# EAGLE design 608_donkey (EAGLE 9.6.2)
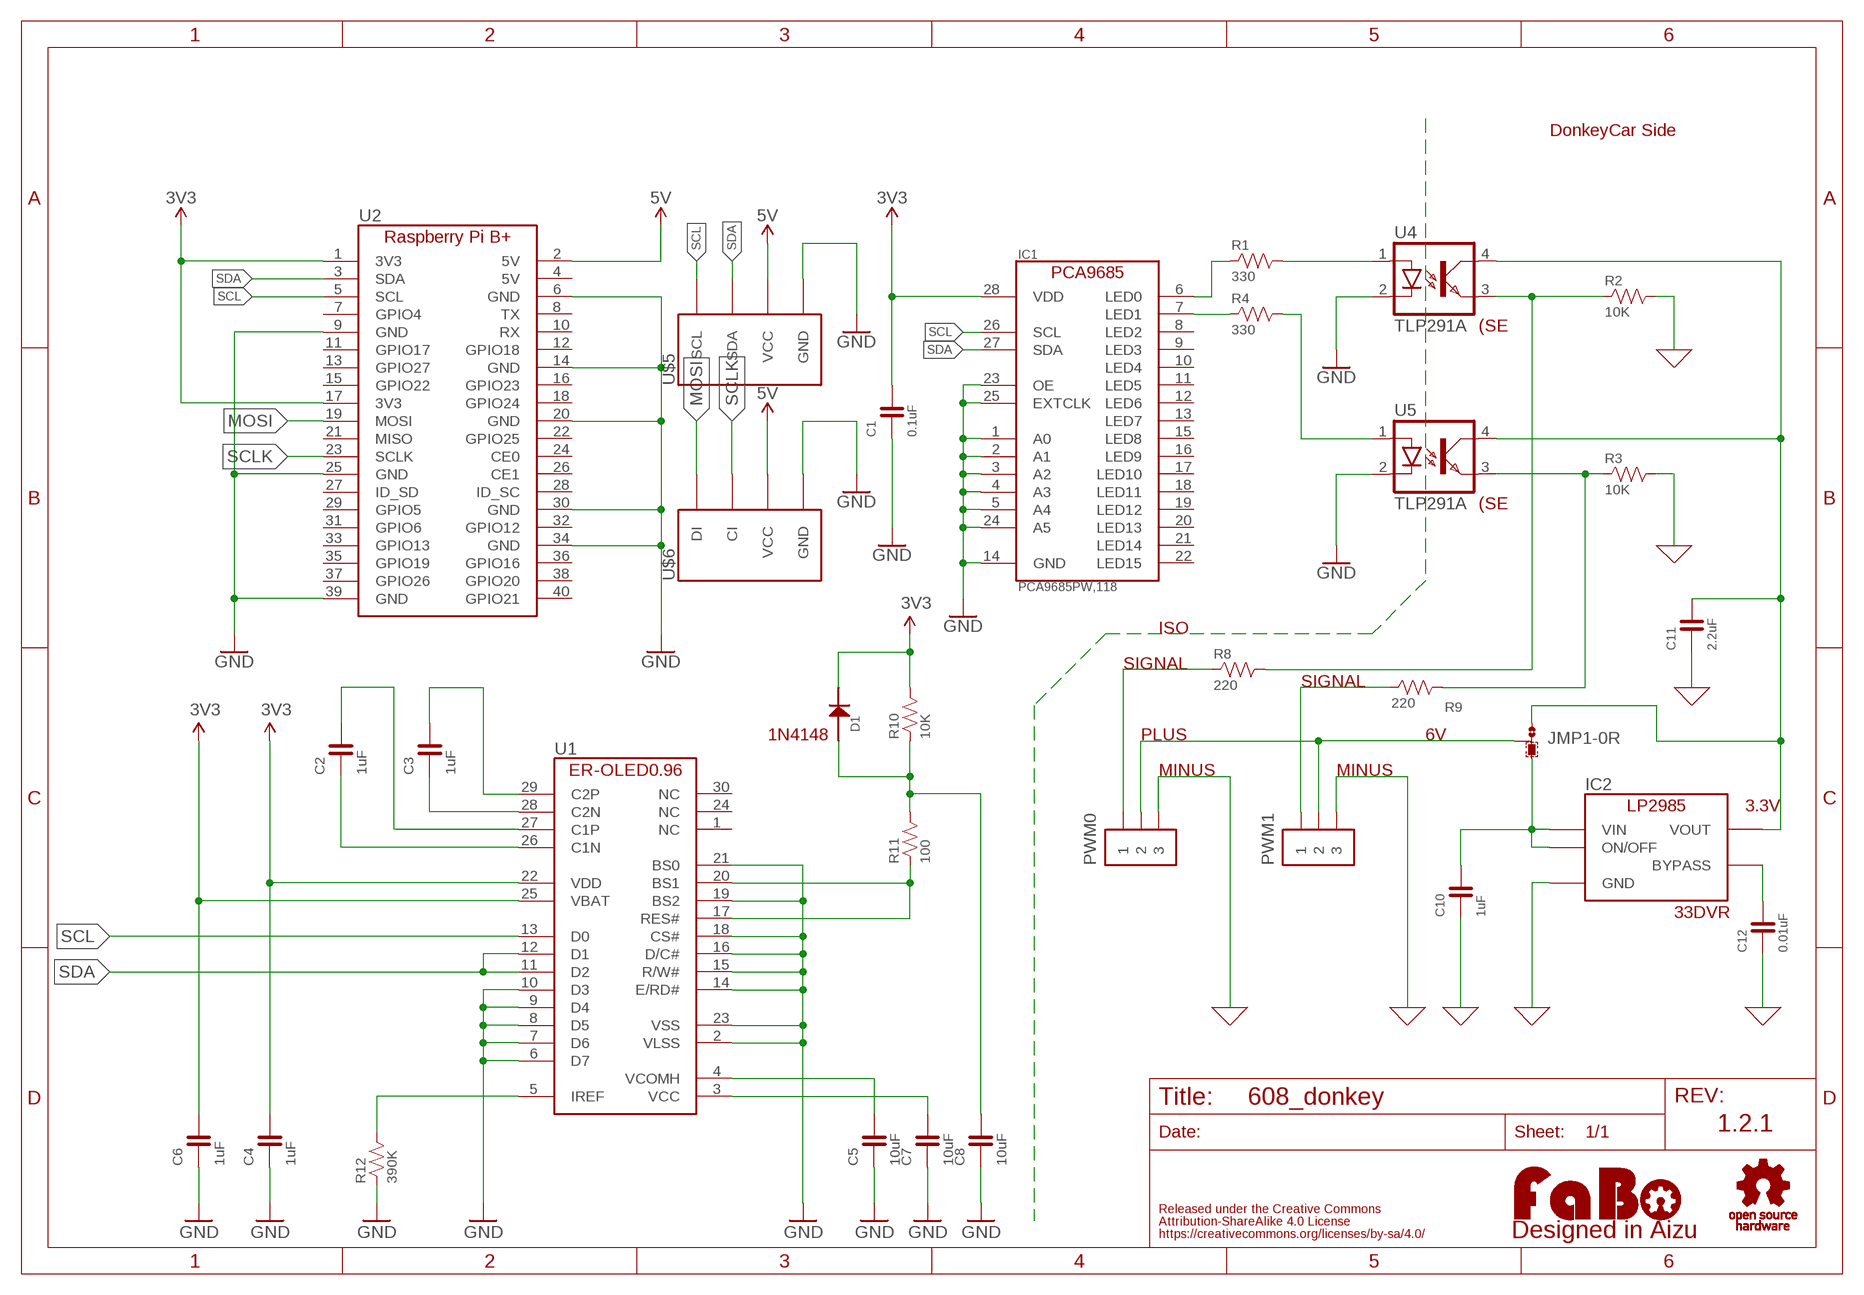
[diagram p0: schematic, sheet 1]

## Parts
C1  0.1uF  CAPACITOR-0603  [EIA0603]
C2  1uF  CAPACITOR-0603-BOTTOM  [0603-BOTTOM]
C3  1uF  CAPACITOR-0603-BOTTOM  [0603-BOTTOM]
C4  1uF  CAPACITOR-0603-BOTTOM  [0603-BOTTOM]
C5  10uF  CAPACITOR-0603-BOTTOM  [0603-BOTTOM]
C6  1uF  CAPACITOR-0603-BOTTOM  [0603-BOTTOM]
C7  10uF  CAPACITOR-0603-BOTTOM  [0603-BOTTOM]
C8  10uF  CAPACITOR-0603-BOTTOM  [0603-BOTTOM]
C10  1uF  CAPACITOR-0603  [EIA0603]
C11  2.2uF  CAPACITOR-0603  [EIA0603]
C12  0.01uF  CAPACITOR-0603  [EIA0603]
D1  1N4148  [1N4148W]
IC1  PCA9685PW,118  PCA9685PW  [TSSOP-28]
IC2  LP2985-33DBV  [SOT-23-5]
JMP1  0R-JUMPB  [B0R-JMP]
LOGO1  LOGO_FABO-M  [LOGO_FABO_M]
PWM0  PIN_HEADER_1X3  [PIN_1X3]
PWM1  PIN_HEADER_1X3  [PIN_1X3]
R1  330  RESISTOR-0603-NARROW  [0603-NARROW]
R2  10K  RESISTOR-0603-NARROW  [0603-NARROW]
R3  10K  RESISTOR-0603-NARROW  [0603-NARROW]
R4  330  RESISTOR-0603-NARROW  [0603-NARROW]
R8  220  RESISTOR-0603-NARROW  [0603-NARROW]
R9  220  RESISTOR-0603-NARROW  [0603-NARROW]
R10  10K  RESISTOR-0603-BOTTOM  [0603-BOTTOM]
R11  100  RESISTOR-0603-BOTTOM  [0603-BOTTOM]
R12  390K  RESISTOR-0603-BOTTOM  [0603-BOTTOM]
U1  ER-OLED0.96-1ER-CON30HT-1  [ER-CON30HT-1]
U2  RASPBERRY_PI_B+MINI  [RASPBERRY_PI_B+_MINI]
U4  TLP291A  [11-3C1]
U5  TLP291A  [11-3C1]
U$2  LOGO_OSHW-M_BOTTOM  [LOGO_OSHW_M_BOTTOM]
U$5  FABO-I2C_BM04B  [I2C-BM04B-PASS-1]
U$6  FABO-SPI-LED  [SPI-BM04B-PASS-1]

## Nets
0: C10.1 C11.1 C12.1 IC2.2(GND) PWM0.3 PWM1.3 R2.2 R3.2 ; supply symbol labelled GND
3V3: C1.2 C6.2 D1.CATHODE IC1.28(VDD) R10.2 U1.25(VBAT) U2.1(3V3) U2.17(3V3)
5V: U2.2(5V) U$5.5V(VCC) U$6.5V(VCC)
GND: C1.1 C4.1 C5.1 C6.1 C7.1 C8.1 IC1.1(A0) IC1.2(A1) IC1.3(A2) IC1.4(A3) IC1.5(A4) IC1.14(GND) IC1.23(OE) IC1.24(A5) IC1.25(EXTCLK) R12.1 U1.2(VLSS) U1.6(D7) U1.7(D6) U1.8(D5) U1.9(D4) U1.10(D3) U1.14(E/RD#) U1.15(R/W#) U1.16(D/C#) U1.18(CS#) U1.19(BS2) U1.21(BS0) U1.23(VSS) U2.6(GND) U2.9(GND) U2.14(GND) U2.20(GND) U2.25(GND) U2.30(GND) U2.34(GND) U2.39(GND) U4.2(C) U5.2(C) U$5.GND U$6.GND
MOSI: U2.19(MOSI) U$6.DI
N$1: R2.1 R8.2 U4.3(EMI)
N$2: R1.2 U4.1(A)
N$3: R4.2 U5.1(A)
N$4: C11.2 IC2.5(VOUT) JMP1.3 U4.4(COL) U5.4(COL)
N$5: R3.1 R9.2 U5.3(EMI)
N$7: C2.1 U1.26(C1N)
N$10: C10.2 IC2.1(VIN) IC2.3(ON/OFF) JMP1.1
N$12: JMP1.2 PWM0.2 PWM1.2
N$14: C2.2 U1.27(C1P)
N$16: C12.2 IC2.4(BYPASS)
N$17: PWM0.1 R8.1
N$18: PWM1.1 R9.1
N$19: C3.1 U1.28(C2N)
N$21: C3.2 U1.29(C2P)
N$23: R12.2 U1.5(IREF)
N$24: C5.2 U1.4(VCOMH)
N$25: C7.2 U1.3(VCC)
N$26: R11.1 U1.17(RES#) U1.20(BS1)
N$27: C8.2 D1.ANODE R10.1 R11.2
N$30: C4.2 U1.22(VDD) ; supply symbol labelled 3V3
PIN_LED0: IC1.6(LED0) R1.1
PIN_LED1: IC1.7(LED1) R4.1
SCL: IC1.26(SCL) U1.13(D0) U2.5(SCL) U$5.SCL
SCLK: U2.23(SCLK) U$6.CI
SDA: IC1.27(SDA) U1.11(D2) U1.12(D1) U2.3(SDA) U$5.SDA
Unconnected: IC1.8(LED2) IC1.9(LED3) IC1.10(LED4) IC1.11(LED5) IC1.12(LED6) IC1.13(LED7) IC1.15(LED8) IC1.16(LED9) IC1.17(LED10) IC1.18(LED11) IC1.19(LED12) IC1.20(LED13) IC1.21(LED14) IC1.22(LED15) U1.1(NC) U1.24(NC) U1.30(NC) U2.4(5V) U2.7(GPIO4) U2.8(TX) U2.10(RX) U2.11(GPIO17) U2.12(GPIO18) U2.13(GPIO27) U2.15(GPIO22) U2.16(GPIO23) U2.18(GPIO24) U2.21(MISO) U2.22(GPIO25) U2.24(CE0) U2.26(CE1) U2.27(ID_SD) U2.28(ID_SC) U2.29(GPIO5) U2.31(GPIO6) U2.32(GPIO12) U2.33(GPIO13) U2.35(GPIO19) U2.36(GPIO16) U2.37(GPIO26) U2.38(GPIO20) U2.40(GPIO21)

## Notes on the sheet
- DonkeyCar Side
- (SE
- (SE
- ISO
- SIGNAL
- SIGNAL
- 1N4148 | PLUS | 6V
- MINUS | MINUS
- 3.3V
- 33DVR
- 1.2.1

## Library data of the parts
C1 C10-C12 = component:CAPACITOR
C2-C8 = FaBo-Capacitor:CAPACITOR: CAPACITOR
D1 = FaBo-Diode:1N4148
IC1 = component:PCA9685
IC2 = FaBo-Supply:LP2985: LP2985
JMP1 = jump-0r-smd:0R-JUMP: SMD 0R 0805 Jumper
LOGO1 = component:LOGO_FABO
PWM0 PWM1 = FaBo-PIN:PIN_HEADER_1X3
R1-R4 R8-R12 = FaBo-Resistors:RESISTOR: RESISTOR
U1 = FaBo-Display:ER-OLED0.96-1
U2 = FaBo-Boards:RASPBERRY_PI_B+
U4 U5 = FaBo_Photocoupler:TLP291A
U$2 = component:LOGO_OSHW
U$5 = FaBo-Connetor:FABO-I2C
U$6 = FaBo-Connetor:FABO-SPI-LED

## Board
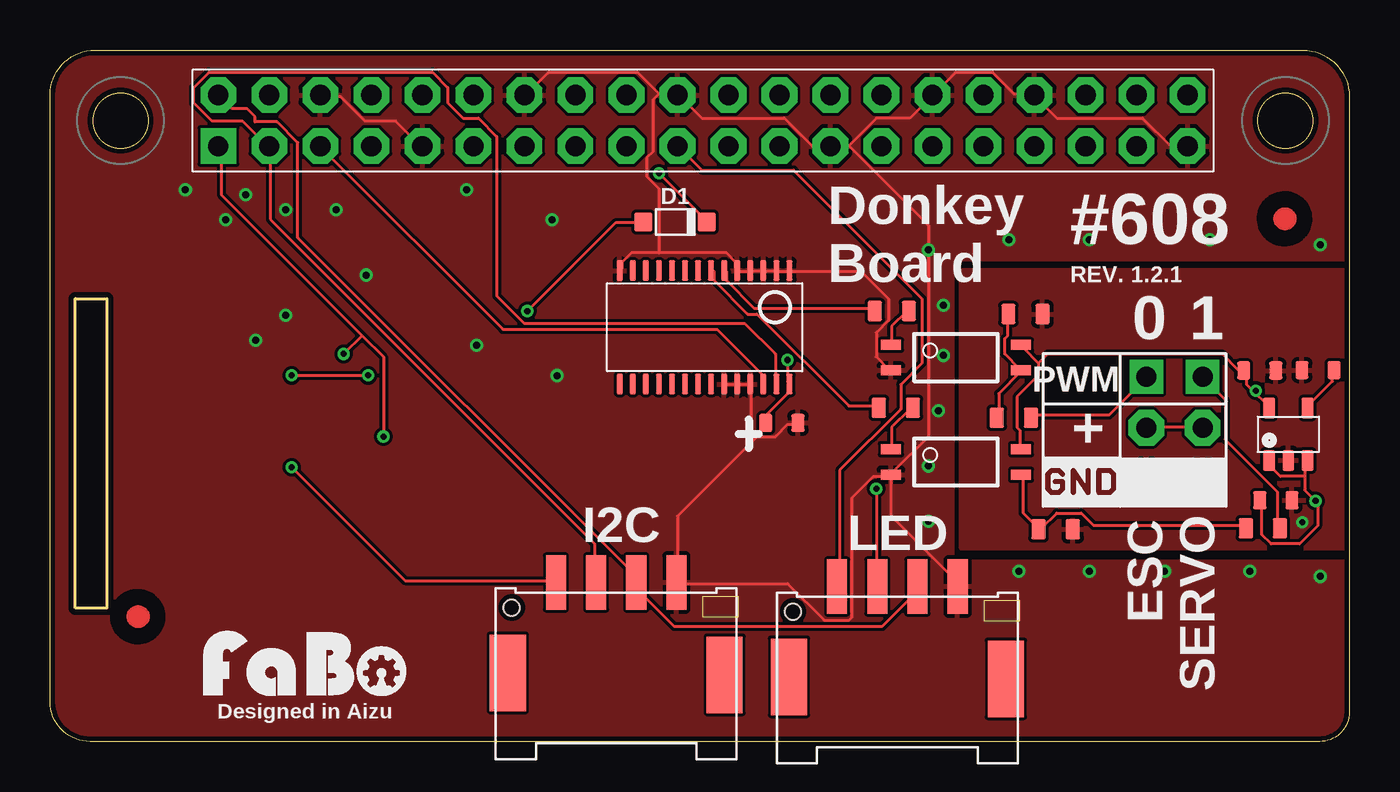
[diagram p1: board, top side]
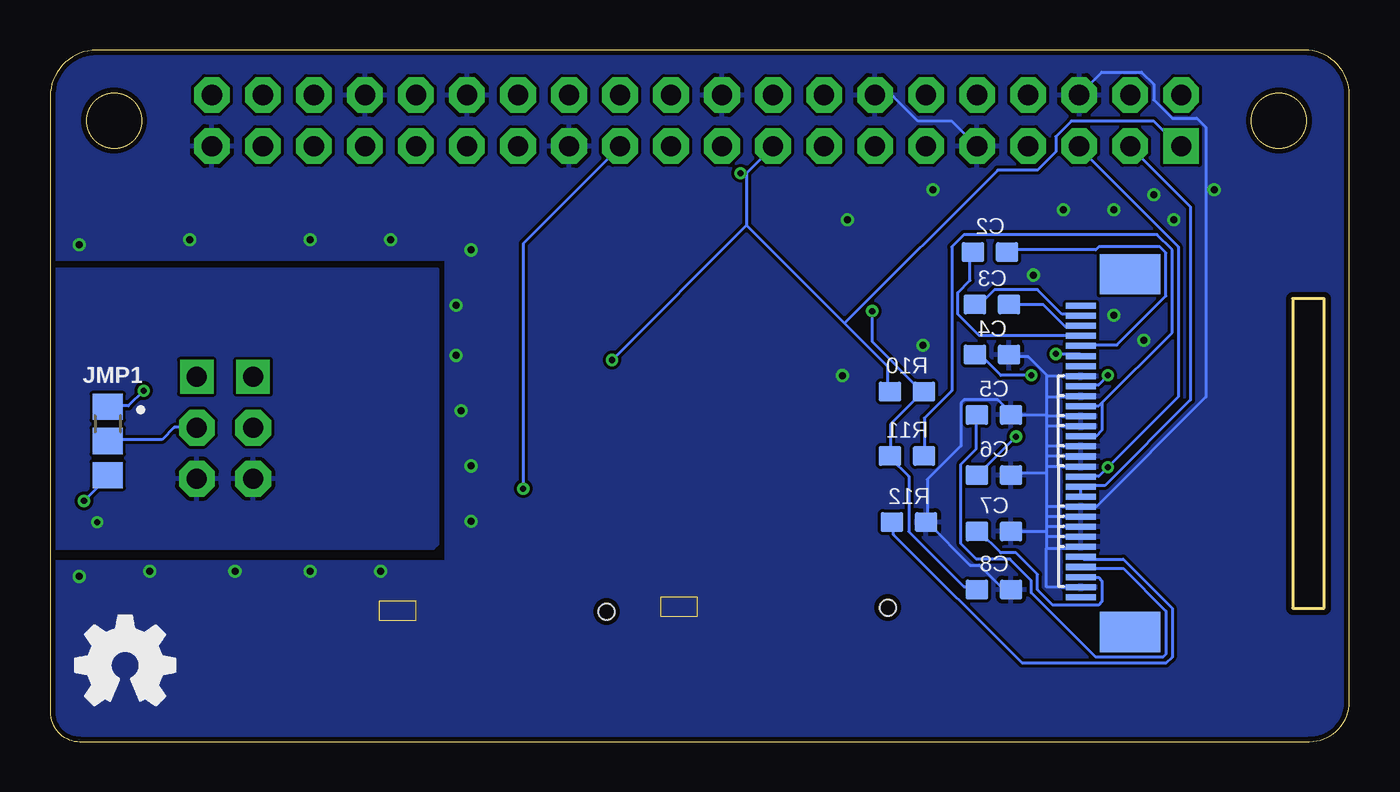
[diagram p2: board, bottom side, seen from below]

Size 64.68 x 34.41 mm. Coordinates in mm from the lower left corner, seen from the top.
Outline: 1.25,22.05 2.82,22.05 2.82,6.64 1.25,6.64 1.25,22.05
Copper layers (1*16): Top 0.035mm / dielectric 1.6mm / Bottom 0.035mm
Design rules "PCBway": minimum track width 6mil, minimum drill 12mil, track to track 6mil, track to pad 6mil, pad to pad 6mil, via to via 6mil, smd to smd 6mil, copper to edge 10mil, drill to drill 10mil, minimum pad ring 10mil, minimum via ring 6mil, stop-mask expansion 2mil, vias tented up to drill 100mil, thermal gap 8mil

### Footprints (pad centres in the part's own frame; a part is rotated, then mirrored left to right if it is on the bottom)
EIA0603 = smd 0.65 x 0.9: 1 -0.8,0; 2 0.8,0
0603-BOTTOM = smd 1.1 x 1 bottom: 1 -0.85,0; 2 0.85,0
1N4148W = smd 0.9 x 0.95: ANODE 0,0; CATHODE 3.15,0
TSSOP-28 = smd 0.3 x 1: 1 -4.225,-2.825; 2 -3.575,-2.825; 3 -2.925,-2.825; 4 -2.275,-2.825; 5 -1.625,-2.825; 6 -0.975,-2.825; 7 -0.325,-2.825; 8 0.325,-2.825; 9 0.975,-2.825; 10 1.625,-2.825; 11 2.275,-2.825; 12 2.925,-2.825; 13 3.575,-2.825; 14 4.225,-2.825; 15 4.225,2.825; 16 3.575,2.825; 17 2.925,2.825; 18 2.275,2.825; 19 1.625,2.825; 20 0.975,2.825; 21 0.325,2.825; 22 -0.325,2.825; 23 -0.975,2.825; 24 -1.625,2.825; 25 -2.275,2.825; 26 -2.925,2.825; 27 -3.575,2.825; 28 -4.225,2.825
SOT-23-5 = smd 0.6 x 1.05: 1 -0.95,-1.3; 2 0,-1.3; 3 0.95,-1.3; 4 0.95,1.3; 5 -0.95,1.3
B0R-JMP = smd 1.5 x 1.3: 1 0,1.7; 2 0,0; 3 0,-1.7
PIN_1X3 = drill 1 pad 1.676 square: 1 -2.54,0 | drill 1 pad 1.778 octagon: 2 0,0; 3 2.54,0
0603-NARROW = smd 0.71 x 1: 1 -0.85,0; 2 0.85,0
ER-CON30HT-1 = smd 0.3 x 1.5 bottom: 1 7,-0.23; 2 6.5,-0.23; 3 6,-0.23; 4 5.5,-0.23; 5 5,-0.23; 6 4.5,-0.23; 7 4,-0.23; 8 3.5,-0.23; 9 3,-0.23; 10 2.5,-0.23; 11 2,-0.23; 12 1.5,-0.23; 13 1,-0.23; 14 0.5,-0.23; 15 0,-0.23; 16 -0.5,-0.23; 17 -1,-0.23; 18 -1.5,-0.23; 19 -2,-0.23; 20 -2.5,-0.23; 21 -3,-0.23; 22 -3.5,-0.23; 23 -4,-0.23; 24 -4.5,-0.23; 25 -5,-0.23; 26 -5.5,-0.23; 27 -6,-0.23; 28 -6.5,-0.23; 29 -7,-0.23; 30 -7.5,-0.23 | smd 2 x 3 bottom: 31 -9.07,-2.67; 32 8.74,-2.67
RASPBERRY_PI_B+_MINI = drill 1 pad 1.778 square: 1 8.89,-5.08 | drill 1 pad 1.778 octagon: 2 8.89,-2.54; 3 11.43,-5.08; 4 11.43,-2.54; 5 13.97,-5.08; 6 13.97,-2.54; 7 16.51,-5.08; 8 16.51,-2.54; 9 19.05,-5.08; 10 19.05,-2.54; 11 21.59,-5.08; 12 21.59,-2.54; 13 24.13,-5.08; 14 24.13,-2.54; 15 26.67,-5.08; 16 26.67,-2.54; 17 29.21,-5.08; 18 29.21,-2.54; 19 31.75,-5.08; 20 31.75,-2.54; 21 34.29,-5.08; 22 34.29,-2.54; 23 36.83,-5.08; 24 36.83,-2.54; 25 39.37,-5.08; 26 39.37,-2.54; 27 41.91,-5.08; 28 41.91,-2.54; 29 44.45,-5.08; 30 44.45,-2.54; 31 46.99,-5.08; 32 46.99,-2.54; 33 49.53,-5.08; 34 49.53,-2.54; 35 52.07,-5.08; 36 52.07,-2.54; 37 54.61,-5.08; 38 54.61,-2.54; 39 57.15,-5.08; 40 57.15,-2.54
11-3C1 = smd 1 x 0.5: 1 -3.24,0.635; 2 -3.24,-0.635; 3 3.24,-0.635; 4 3.24,0.635
I2C-BM04B-PASS-1 = smd 1 x 2.7: 5V -1,0; GND -3,0; SCL 3,0; SDA 1,0 | smd 1.8 x 3.8: P$5 -5.4,4.6; P$6 5.4,4.5 | hole 0.8: 5.2,1.25
SPI-BM04B-PASS-1 = smd 1 x 2.7: 5V -1,-0.1; CI 1,-0.1; DI 3,-0.1; GND -3,-0.1 | smd 1.8 x 3.8: P$5 -5.4,4.5; P$6 5.4,4.4 | hole 0.8: 5.2,1.15

### Placement (x,y rotation side)
C1  36.43,15.86 180 top
C2  17.89,24.36 0 top
C3  17.79,21.76 0 top
C4  17.79,19.26 0 top
C5  17.69,16.26 0 top
C6  17.69,13.26 0 top
C7  17.69,10.46 0 top
C8  17.69,7.56 0 top
C10  61.02,12.01 180 top
C11  60.22,18.47 180 top
C12  63.12,18.49 0 top
D1  29.53,25.85 0 top
IC1  32.58,20.62 180 top
IC2  61.64,15.3 0 top
JMP1  61.82,14.96 180 bottom
LOGO1  12.68,1.89 0 top
PWM0  54.58,15.62 270 top
PWM1  57.38,15.62 270 bottom
R1  41.9,21.43 0 top
R2  48.56,21.28 0 top
R3  50.06,10.56 0 top
R4  42.1,16.61 0 top
R8  47.98,16.12 180 top
R9  60.38,10.62 180 top
R10  22.02,17.42 0 top
R11  22.02,14.22 0 top
R12  21.92,10.92 0 top
U1  13.59,14.19 270 top
U2  -0.52,34.72 0 top
U4  45.1,19.11 0 top
U5  45.1,13.91 0 top
U$2  60.94,3.8 0 top
U$3  [MARK_POINT_3MM]  4.38,6.22 0 top
U$4  [MARK_POINT_3MM]  61.48,26.02 0 top
U$5  28.18,7.92 180 top
U$6  42.18,7.62 180 top
U$19  [LOGO_SILK_GND]  49.39,11.68 0 top

### Tracks (layer width: path | path; a pad name or v marks a point on that pad's centre or on a via)
0  (via drill 0.3)
  other vias: 62.34,10.91
  pour Top: 45.38,23.46 65.38,23.46 65.38,9.62 45.38,9.62
  pour Bottom: 45.38,23.52 65.36,23.52 65.36,9.62 45.58,9.62 45.38,9.82
3V3  (via drill 0.3)
  Top 0.152: C1.2 35.64,15.94 35.64,16.25 36.71,17.31 36.71,17.77 IC1.28 36.71,17.92 v36.71,18.99 | v30.31,28.29 32.59,26 D1.CATHODE | v16.59,15.18 16.59,19.14 15.53,20.21 | 15.53,20.21 8.51,27.22 8.51,29.5 U2.1 | 15.53,20.21 v14.61,19.29
  Bottom 0.152: 30,28.29 v30.31,28.29 | 30,28.29 28.78,29.5 U2.17 | 30,25.7 25.13,20.82 | 25.13,20.82 22.99,18.68 22.99,17.46 R10.2 | 30,28.29 30,25.7 | 30,25.7 v36.71,18.99 | v16.59,15.18 18.42,13.35 C6.2 | v14.61,19.29 13.39,19.29 U1.25 | 25.13,20.82 17.51,28.44 15.53,28.44 14.61,29.35 14.61,30.11 13.85,30.88 9.73,30.88 8.51,29.66 U2.1
5V
  Top 0.152: U2.2 9.05,31.5 9.8,31.5 10.2,31.1 10.2,30.85 11.29,30.85 12.32,29.81 12.32,25.08 29.09,8.32 29.09,8.02 U$5.5V 29.24,7.86 29.24,7.56 31.07,5.73 41.43,5.73 43.11,7.41 43.11,7.71 U$6.5V
GND  (via drill 0.35)
  Top 0.152: U5.2 41.89,13.2 41.89,11.22 45.24,7.86 U$6.GND | IC1.23 33.66,17.77 34.12,17.77 IC1.24 34.27,17.77 34.73,17.77 IC1.25 34.88,17.77 34.88,15.48 35.18,15.18 | 35.18,15.18 36.1,15.18 36.71,15.79 37.17,15.79 C1.1 | 35.18,15.18 31.22,11.22 31.22,8.02 U$5.GND 31.22,7.86 36.71,7.86 38.54,6.03 39.76,6.03 39.91,6.19 39.91,12.13 40.98,13.2 41.74,13.2 U5.2 | 39.76,29.66 38.99,29.66 U2.25 38.84,29.66 37.93,29.66 36.56,31.03 32.44,31.03 31.37,32.1 U2.20 31.22,32.25 30.31,32.25 | 39.76,29.66 41.13,31.03 42.8,31.03 43.87,32.1 U2.30 44.02,32.25 45.09,33.31 46.92,33.31 47.99,32.25 48.9,32.25 U2.34 49.05,32.1 50.12,31.03 54.39,31.03 55.76,29.66 56.52,29.66 U2.39 | 39.76,29.66 43.72,25.7 43.72,15.18 41.89,13.35 U5.2 | 30.31,24.32 33.66,24.32 34.12,23.87 34.12,23.56 IC1.5 34.27,23.41 34.73,23.41 IC1.4 34.88,23.41 35.49,23.41 IC1.3 35.64,23.41 36.1,23.41 IC1.2 36.25,23.41 36.71,23.41 IC1.1 36.86,23.41 40.37,23.41 41.74,22.04 41.74,20.97 41.13,20.36 41.13,19.14 41.74,18.53 U4.2 | 30.31,24.32 28.94,24.32 28.48,23.87 28.48,23.56 IC1.14 | U2.6 13.54,32.1 14.46,32.1 15.68,30.88 17.2,30.88 18.42,29.66 U2.9 | 30.31,32.25 29.24,33.31 24.82,33.31 23.75,32.25 U2.14 | 30.31,24.32 30.31,27.52 29.7,28.13 29.7,29.05 30,29.35 30,31.94 30.31,32.25
  Bottom 0.152: U1.2 15.08,7.69 15.08,9.62 | 15.08,9.62 13.36,9.62 U1.6 | U1.7 15.08,10.19 | 15.08,10.19 15.08,9.62 | U1.8 15.08,10.69 | 15.08,10.69 15.08,10.45 | 15.08,10.45 15.08,10.19 | U1.9 15.08,11.19 | 15.08,11.19 15.08,10.69 | 15.08,11.69 U1.10 13.24,11.67 12.63,11.67 7.14,17.16 7.14,30.57 7.6,31.03 8.82,31.03 9.73,31.94 9.73,32.7 10.34,33.31 12.32,33.31 13.39,32.25 U2.6 | 15.08,11.69 15.08,11.19 | U1.19 15.08,16.19 | 15.08,16.19 15.08,15.69 | 15.08,15.69 15.08,14.69 | 15.08,14.69 15.08,14.19 | 15.08,14.19 15.08,13.69 | 15.08,13.69 15.08,13.35 | 15.08,13.35 15.08,11.69 | U1.18 15.08,15.69 | U1.16 15.08,14.69 | U1.15 15.08,14.19 | U1.14 15.08,13.69 | U1.23 15.08,18.19 | 15.08,18.19 15.08,17.16 | 15.08,17.16 15.08,16.19 | C8.1 16.9,7.71 17.35,7.71 18.42,8.78 18.88,8.78 21.01,10.91 R12.1 21.01,11.06 21.01,13.05 19.34,14.72 19.34,16.86 19.18,17.01 17.51,17.01 16.9,16.4 C5.1 16.74,16.25 15.07,16.25 15.08,16.19 | 15.08,10.45 16.74,10.45 C7.1 | 15.07,10.45 15.08,10.45 | 15.08,13.35 16.74,13.35 C6.1 | 15.07,13.35 15.08,13.35 | C4.1 16.9,19.14 15.98,19.14 15.07,18.23 15.08,18.19 | 15.08,17.16 13.39,17.16 U1.21 | U2.14 23.6,32.1 22.69,32.1 21.47,30.88 19.79,30.88 18.57,29.66 U2.9
  other vias: 14.23,26.47 9.73,27.22 11.73,21.22 10.23,19.97 15.73,23.22 20.73,27.47 11.73,26.47 6.73,27.47 8.73,25.97 24.98,25.97 25.23,18.22 21.23,19.72 44.23,16.47 44.48,21.72 43.73,10.97 48.23,8.47 51.73,8.47 55.48,8.47 59.73,8.47 63.23,8.22 43.73,13.72 44.48,19.22 43.73,24.47 47.73,24.97 51.73,24.97 57.73,24.97 63.23,24.72
  pour Bottom: -0.02,-1.28 64.98,-1.28 64.98,8.97 44.98,8.97 44.98,23.97 64.98,23.97 64.98,34.72 -0.02,34.72
  pour Top: -0.02,-1.28 64.98,-1.28 64.98,8.97 44.98,8.97 44.98,23.97 64.98,23.97 64.98,34.72 -0.02,34.72
MOSI
  Top 0.152: U$6.DI 39.3,7.86 39.3,13.5 42.35,16.55 42.35,17.77 43.41,18.84 43.41,22.04 37.01,28.44 32.44,28.44 31.37,29.5 U2.19
N$1
  Top 0.152: R8.2 47.22,16.25 47.22,17.31 48.29,18.38 U4.3 48.29,18.53 47.53,19.29 47.53,20.06 47.68,20.21 47.68,21.27 R2.1
N$2
  Top 0.152: U4.1 41.89,19.75 41.89,20.67 42.65,21.43 R1.2
N$3
  Top 0.152: U5.1 41.89,14.57 41.89,15.64 42.8,16.55 R4.2
N$4  (via drill 0.3)
  Top 0.152: 59.87,17.46 60.63,16.7 IC2.5 | 59.87,17.46 59.57,17.77 59.57,18.38 C11.2 59.42,18.53 59.11,18.53 58.35,19.29 49.66,19.29 49.2,18.84 | 59.87,17.46 v60.03,17.46 | 49.2,18.84 49.2,18.23 48.14,17.16 48.14,15.64 48.29,15.48 48.29,14.57 U5.4 | 49.2,18.84 48.44,19.6 U4.4
  Bottom 0.152: v60.03,17.46 60.79,16.7 61.7,16.7 JMP1.3
N$5
  Top 0.152: U5.3 48.44,13.2 48.44,11.37 49.2,10.61 R3.1 49.36,10.61 50.12,11.37 51.34,11.37 51.95,10.76 59.42,10.76 R9.2
N$7
  Bottom 0.152: C2.1 16.9,24.48 12.63,24.48 12.48,24.63 9.43,24.63 9.12,24.32 9.12,22.19 11.56,19.75 13.24,19.75 U1.26
N$10  (via drill 0.3)
  Top 0.152: 62.46,13.2 62.46,13.96 IC2.3 | 62.46,13.2 62.46,12.51 v63,11.98 63.1,11.88 63.1,10.73 62.21,9.84 60.79,9.84 60.33,10.3 60.33,11.98 C10.2 | 62.46,13.2 61.24,13.2 60.79,13.65 60.79,13.96 IC2.1
  Bottom 0.152: v63,11.98 61.85,13.12 61.85,13.2 JMP1.1
N$12
  Top 0.152: PWM0.2 54.69,15.64 57.28,15.64 PWM1.2
  Bottom 0.152: JMP1.2 61.7,15.03 59.11,15.03 58.5,15.64 57.43,15.64 PWM1.2
N$14
  Bottom 0.152: C2.2 18.88,24.32 18.88,22.95 19.49,22.34 19.49,21.27 18.42,20.21 13.39,20.21 U1.27
N$16
  Top 0.152: C12.2 63.84,18.38 63.84,17.92 62.62,16.7 IC2.4
N$17
  Top 0.152: R8.1 48.9,16.25 52.71,16.25 54.54,18.07 PWM0.1
N$18
  Top 0.152: R9.1 61.09,10.76 61.09,12.44 58.5,15.03 58.5,17.01 57.43,18.07 PWM1.1
N$19
  Bottom 0.152: C3.1 16.9,21.73 15.22,21.73 14.15,20.67 13.39,20.67 U1.28
N$21
  Bottom 0.152: C3.2 18.57,21.88 18.27,21.88 17.66,22.49 15.53,22.49 14.31,21.27 13.39,21.27 U1.29
N$23
  Bottom 0.152: R12.2 22.69,10.91 22.69,10.3 16.29,3.9 9.12,3.9 8.82,4.21 8.82,6.64 11.26,9.08 13.24,9.08 U1.5
N$24
  Bottom 0.152: C5.2 18.57,16.25 18.57,14.57 19.34,13.81 19.34,9.84 18.57,9.08 16.9,9.08 15.83,8.02 15.83,7.41 12.63,4.21 9.28,4.21 9.12,4.36 9.12,6.49 11.26,8.63 13.24,8.63 U1.4
N$25
  Bottom 0.152: C7.2 18.42,10.45 17.35,9.39 16.59,9.39 15.53,8.32 15.53,7.56 14.76,6.8 12.48,6.8 12.32,6.95 12.32,8.02 12.48,8.17 13.24,8.17 U1.3
N$26
  Bottom 0.152: 12.32,16.86 12.48,16.7 13.24,16.7 U1.20 | 12.32,16.86 8.82,20.36 8.82,24.48 9.58,25.24 19.18,25.24 19.79,24.63 19.79,17.46 21.16,16.09 21.16,14.26 R11.1 | 12.32,16.86 12.32,15.48 12.63,15.18 13.24,15.18 U1.17
N$27  (via drill 0.3)
  Top 0.152: v23.75,21.43 28.17,25.85 29.39,25.85 D1.ANODE
  Bottom 0.152: C8.2 18.57,7.71 19.18,7.71 21.93,10.45 21.93,13.2 22.84,14.11 R11.2 22.84,14.26 22.84,15.79 21.32,17.31 R10.1 21.32,17.46 23.75,19.9 v23.75,21.43
N$30  (via drill 0.3)
  Top 0.152: v12.02,18.23 v15.83,18.23
  Bottom 0.152: v15.83,18.23 17.35,18.23 18.27,19.14 18.57,19.14 C4.2 | v12.02,18.23 12.48,17.77 13.24,17.77 U1.22
PIN_LED0
  Top 0.152: R1.1 40.98,21.58 35.03,21.58 33.66,22.95 33.66,23.41 IC1.6
PIN_LED1
  Top 0.152: R4.1 41.13,16.7 39.76,16.7 35.18,21.27 34.73,21.27 33.05,22.95 33.05,23.41 IC1.7
SCL  (via drill 0.3)
  Top 0.152: IC1.26 35.49,17.92 35.49,18.23 33.2,20.51 22.54,20.51 13.54,29.5 U2.5 | v12.02,13.65 17.66,8.02 25.13,8.02 U$5.SCL
  Bottom 0.152: U1.13 13.24,13.2 12.48,13.2 v12.02,13.65 8.51,17.16 8.51,24.63 13.39,29.5 U2.5
SCLK  (via drill 0.3)
  Top 0.152: v41.13,12.59 41.13,7.86 U$6.CI
  Bottom 0.152: v41.13,12.59 41.13,24.78 36.4,29.5 U2.23
SDA
  Top 0.152: IC1.27 36.1,17.92 36.1,19.29 34.57,20.82 23.6,20.82 22.23,22.19 22.23,30.11 21.32,31.03 20.55,31.03 19.79,31.79 19.79,32.55 19.03,33.31 7.9,33.31 7.14,32.55 7.14,31.79 8.06,30.88 9.58,30.88 10.8,29.66 U2.3 10.95,29.5 10.95,26 27.11,9.84 27.11,8.02 U$5.SDA
  Bottom 0.152: U1.11 13.39,12.28 13.39,12.59 U1.12 13.24,12.74 12.17,12.74 7.9,17.01 7.9,26.61 10.8,29.5 U2.3

### Text on the board
tPlace: #608 | Donkey / Board | REV. 1.2.1 | 0 | 1 | PWM | + | I2C | LED | ESC | SERVO | Designed in Aizu